# EAGLE schematic host-1088xel (EAGLE 9.1.1)
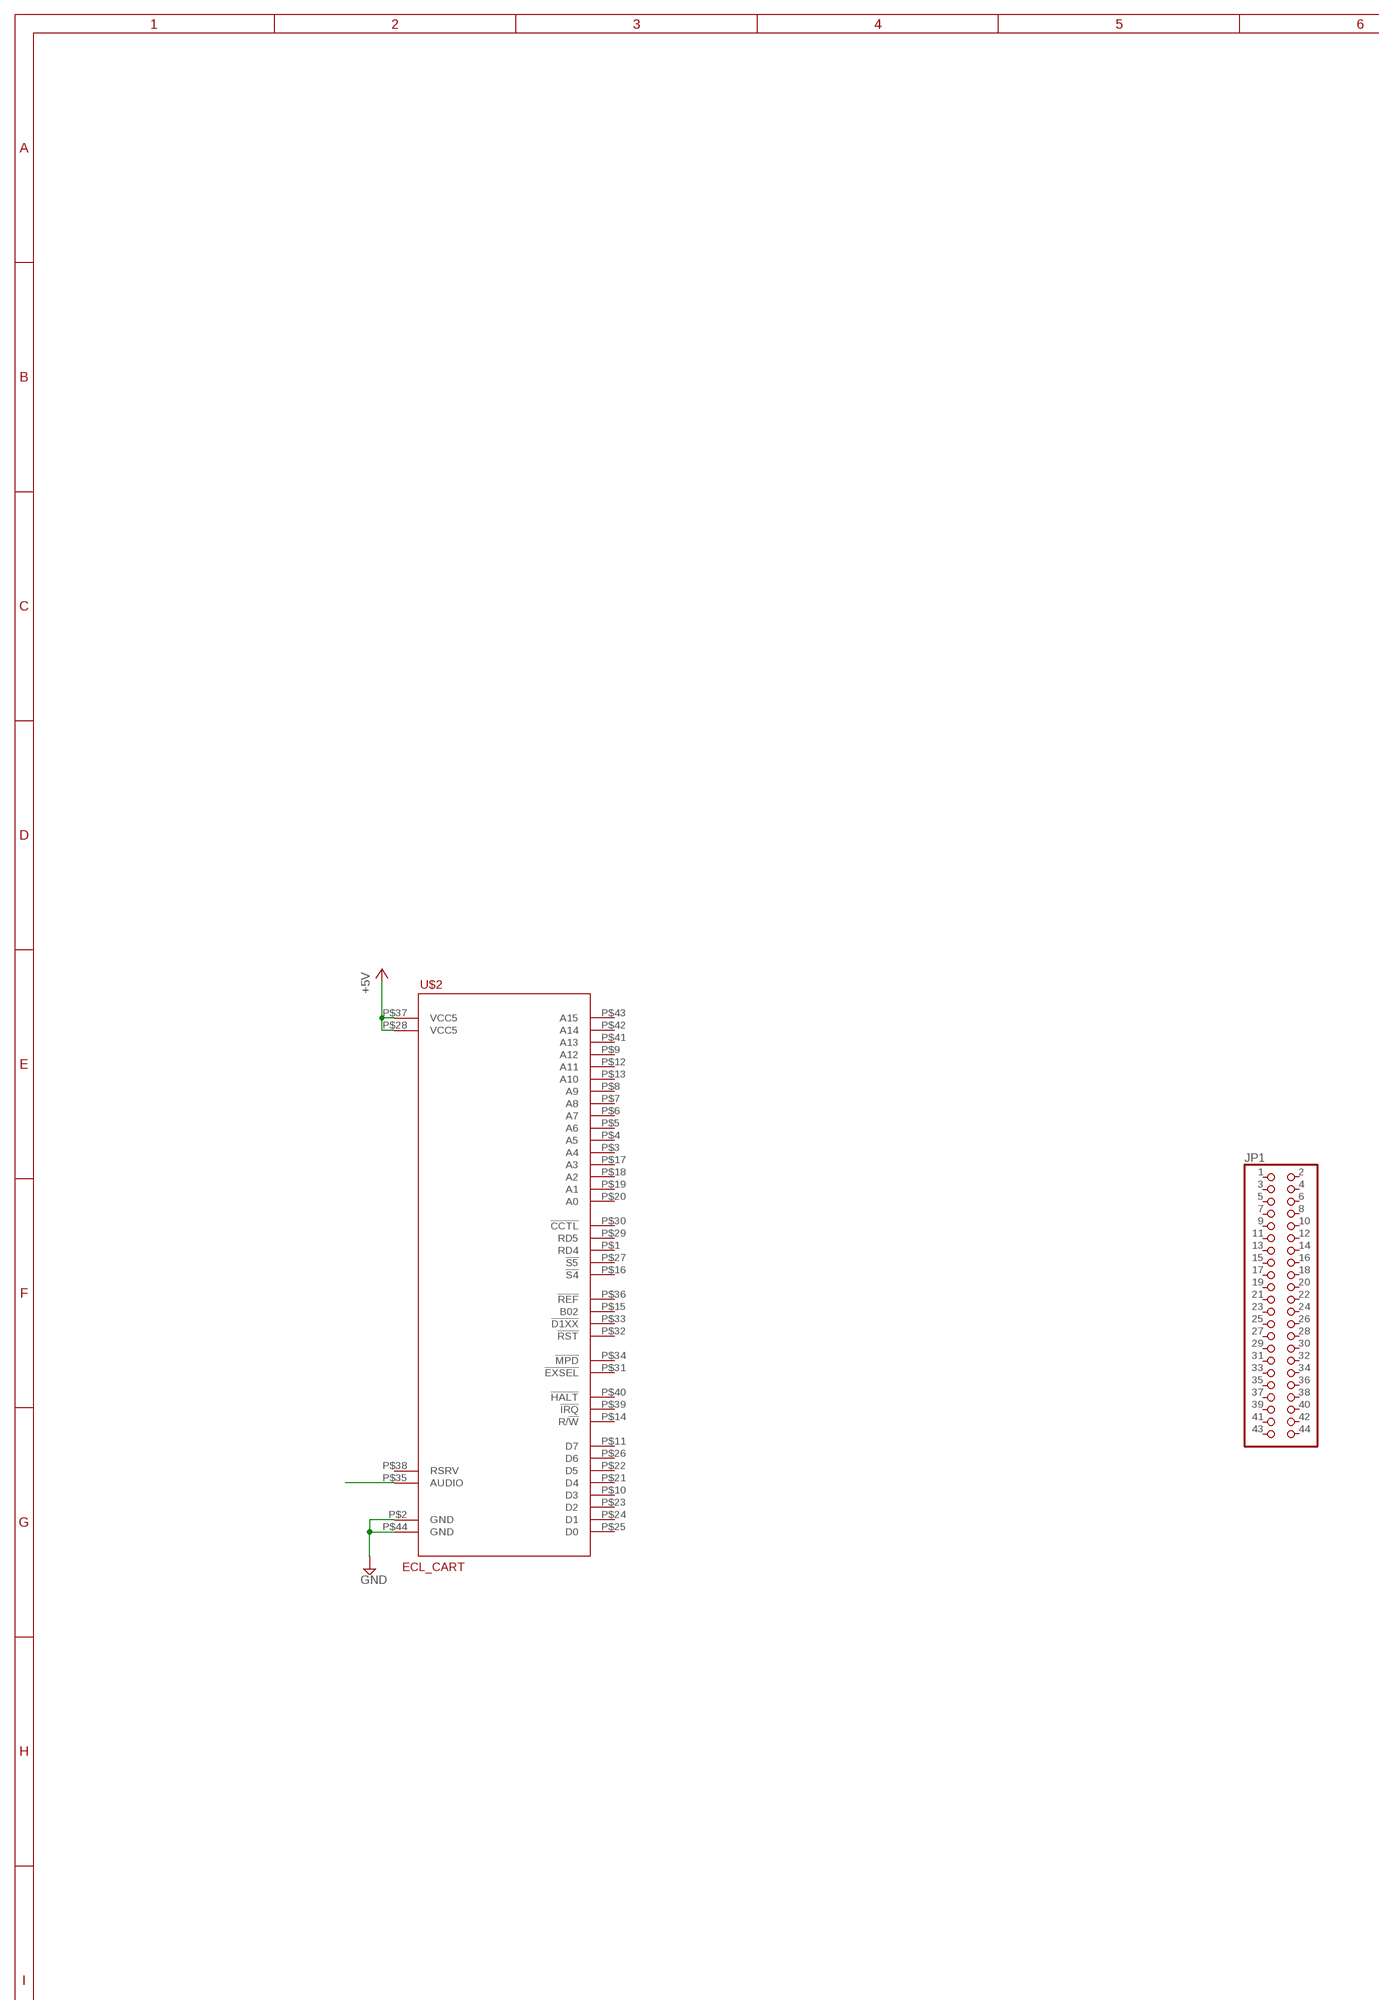
[diagram p0: schematic, sheet 1, part 1 of 2]
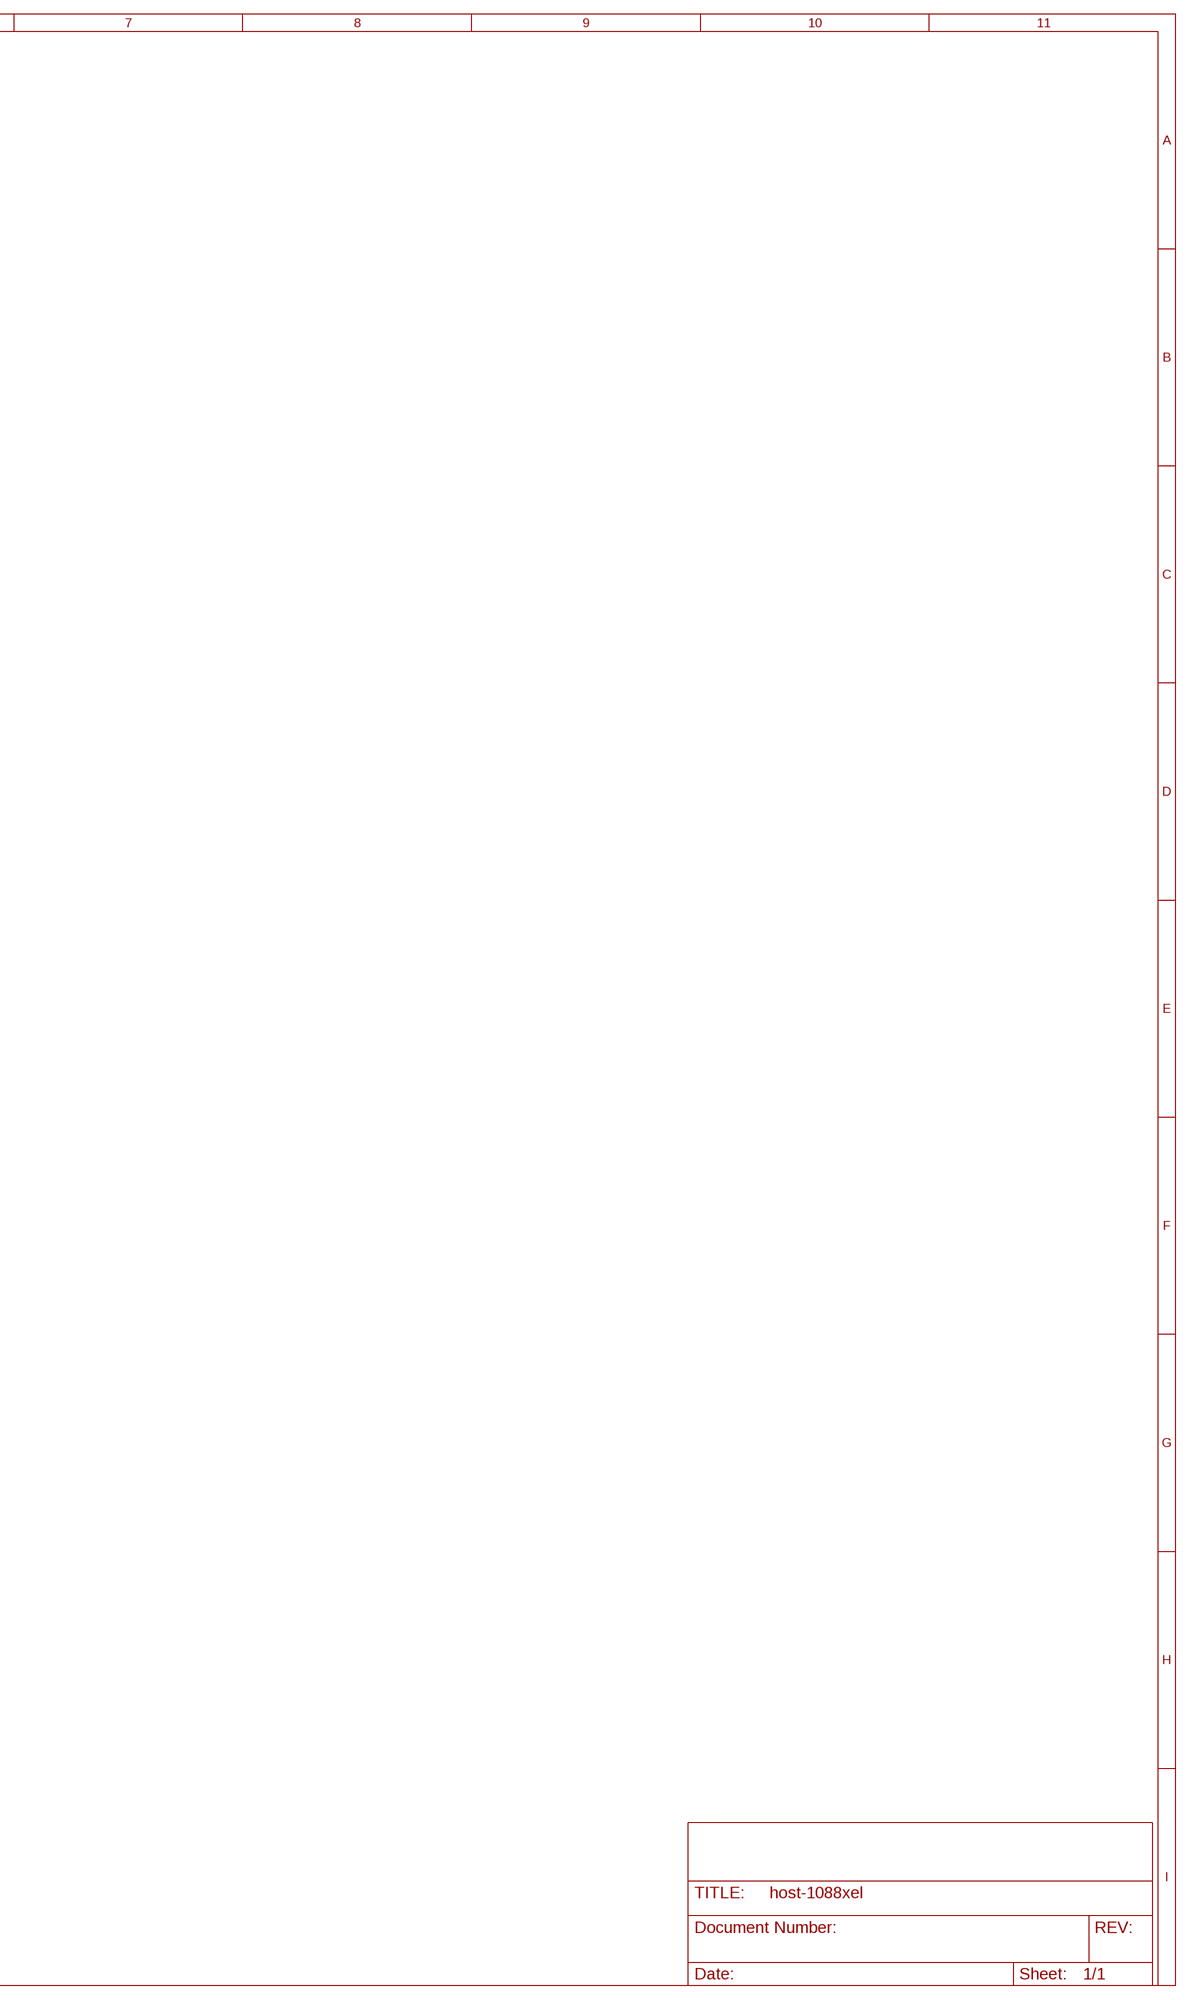
[diagram p1: schematic, sheet 1, part 2 of 2]

## Parts
JP1  PINHD-2X22  [2X22]
U$2  ECL_CART  [ECL_CART]

## Nets
+5V: U$2.P$28(VCC5) U$2.P$37(VCC5)
AUDIO: U$2.P$35(AUDIO)
GND: U$2.P$2(GND) U$2.P$44(GND)
Unconnected: JP1.1 JP1.2 JP1.3 JP1.4 JP1.5 JP1.6 JP1.7 JP1.8 JP1.9 JP1.10 JP1.11 JP1.12 JP1.13 JP1.14 JP1.15 JP1.16 JP1.17 JP1.18 JP1.19 JP1.20 JP1.21 JP1.22 JP1.23 JP1.24 JP1.25 JP1.26 JP1.27 JP1.28 JP1.29 JP1.30 JP1.31 JP1.32 JP1.33 JP1.34 JP1.35 JP1.36 JP1.37 JP1.38 JP1.39 JP1.40 JP1.41 JP1.42 JP1.43 JP1.44 U$2.P$1(RD4) U$2.P$3(A4) U$2.P$4(A5) U$2.P$5(A6) U$2.P$6(A7) U$2.P$7(A8) U$2.P$8(A9) U$2.P$9(A12) U$2.P$10(D3) U$2.P$11(D7) U$2.P$12(A11) U$2.P$13(A10) U$2.P$14(R/!W!) U$2.P$15(B02) U$2.P$16(!S4!) U$2.P$17(A3) U$2.P$18(A2) U$2.P$19(A1) U$2.P$20(A0) U$2.P$21(D4) U$2.P$22(D5) U$2.P$23(D2) U$2.P$24(D1) U$2.P$25(D0) U$2.P$26(D6) U$2.P$27(!S5!) U$2.P$29(RD5) U$2.P$30(!CCTL!) U$2.P$31(!EXSEL!) U$2.P$32(!RST!) U$2.P$33(!D1XX!) U$2.P$34(!MPD!) U$2.P$36(!REF!) U$2.P$38(RSRV) U$2.P$39(!IRQ!) U$2.P$40(!HALT!) U$2.P$41(A13) U$2.P$42(A14) U$2.P$43(A15)

## Library data of the parts
JP1 = pinhead:PINHD-2X22: PIN HEADER
U$2 = Atari:ECL_CART